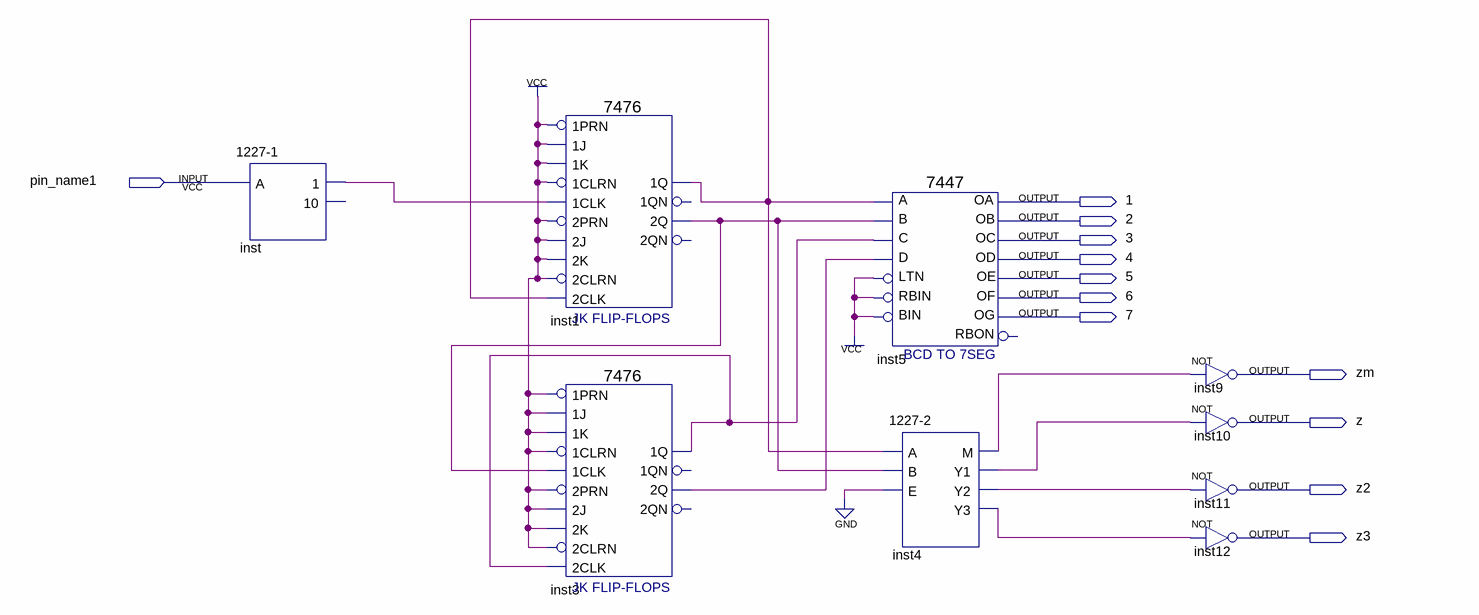
[diagram p0: schematic sheet]
// Quartus schematic 1227-3.bdf as structural Verilog: 9 symbols, 12 pins
module \1227-3  (
  input  pin_name1,
  output \1 ,
  output \2 ,
  output \3 ,
  output \4 ,
  output \5 ,
  output \6 ,
  output \7 ,
  output zm,
  output z,
  output z2,
  output z3
);

  wire inst1_1q, inst1_2q, inst3_1q, inst3_2q, inst4_m, inst4_y1, inst4_y2, inst4_y3, inst_1;

  \1227-1  inst (.A(pin_name1), .\1 (inst_1));  // open: 10
  \7476  inst1 (
    .\1J (1'b1), .\1K (1'b1), .\1PRN (1'b1), .\2PRN (1'b1), .\2J (1'b1), .\1CLK (inst_1), .\1CLRN (1'b1),
    .\2K (1'b1), .\2CLRN (1'b1), .\2CLK (inst1_1q), .\1Q (inst1_1q), .\2Q (inst1_2q));  // open: 2QN, 1QN
  \7476  inst3 (
    .\1J (1'b1), .\1K (1'b1), .\1PRN (1'b1), .\2PRN (1'b1), .\2J (1'b1), .\1CLK (inst1_2q), .\1CLRN (1'b1),
    .\2K (1'b1), .\2CLRN (1'b1), .\2CLK (inst3_1q), .\1Q (inst3_1q), .\2Q (inst3_2q));  // open: 2QN, 1QN
  \7447  inst5 (
    .LTN(1'b1), .B(inst1_2q), .C(inst3_1q), .D(inst3_2q), .RBIN(1'b1), .BIN(1'b1), .A(inst1_1q), .OB(\2 ),
    .OC(\3 ), .OE(\5 ), .OD(\4 ), .OF(\6 ), .OG(\7 ), .OA(\1 ));  // open: RBON
  \1227-2  inst4 (.A(inst1_1q), .B(inst1_2q), .E(1'b0), .M(inst4_m), .Y1(inst4_y1), .Y2(inst4_y2), .Y3(inst4_y3));
  not inst9 (zm, inst4_m);
  not inst10 (z, inst4_y1);
  not inst11 (z2, inst4_y2);
  not inst12 (z3, inst4_y3);
endmodule
